# EAGLE design B-CAN-giraffe (EAGLE 9.0.1)
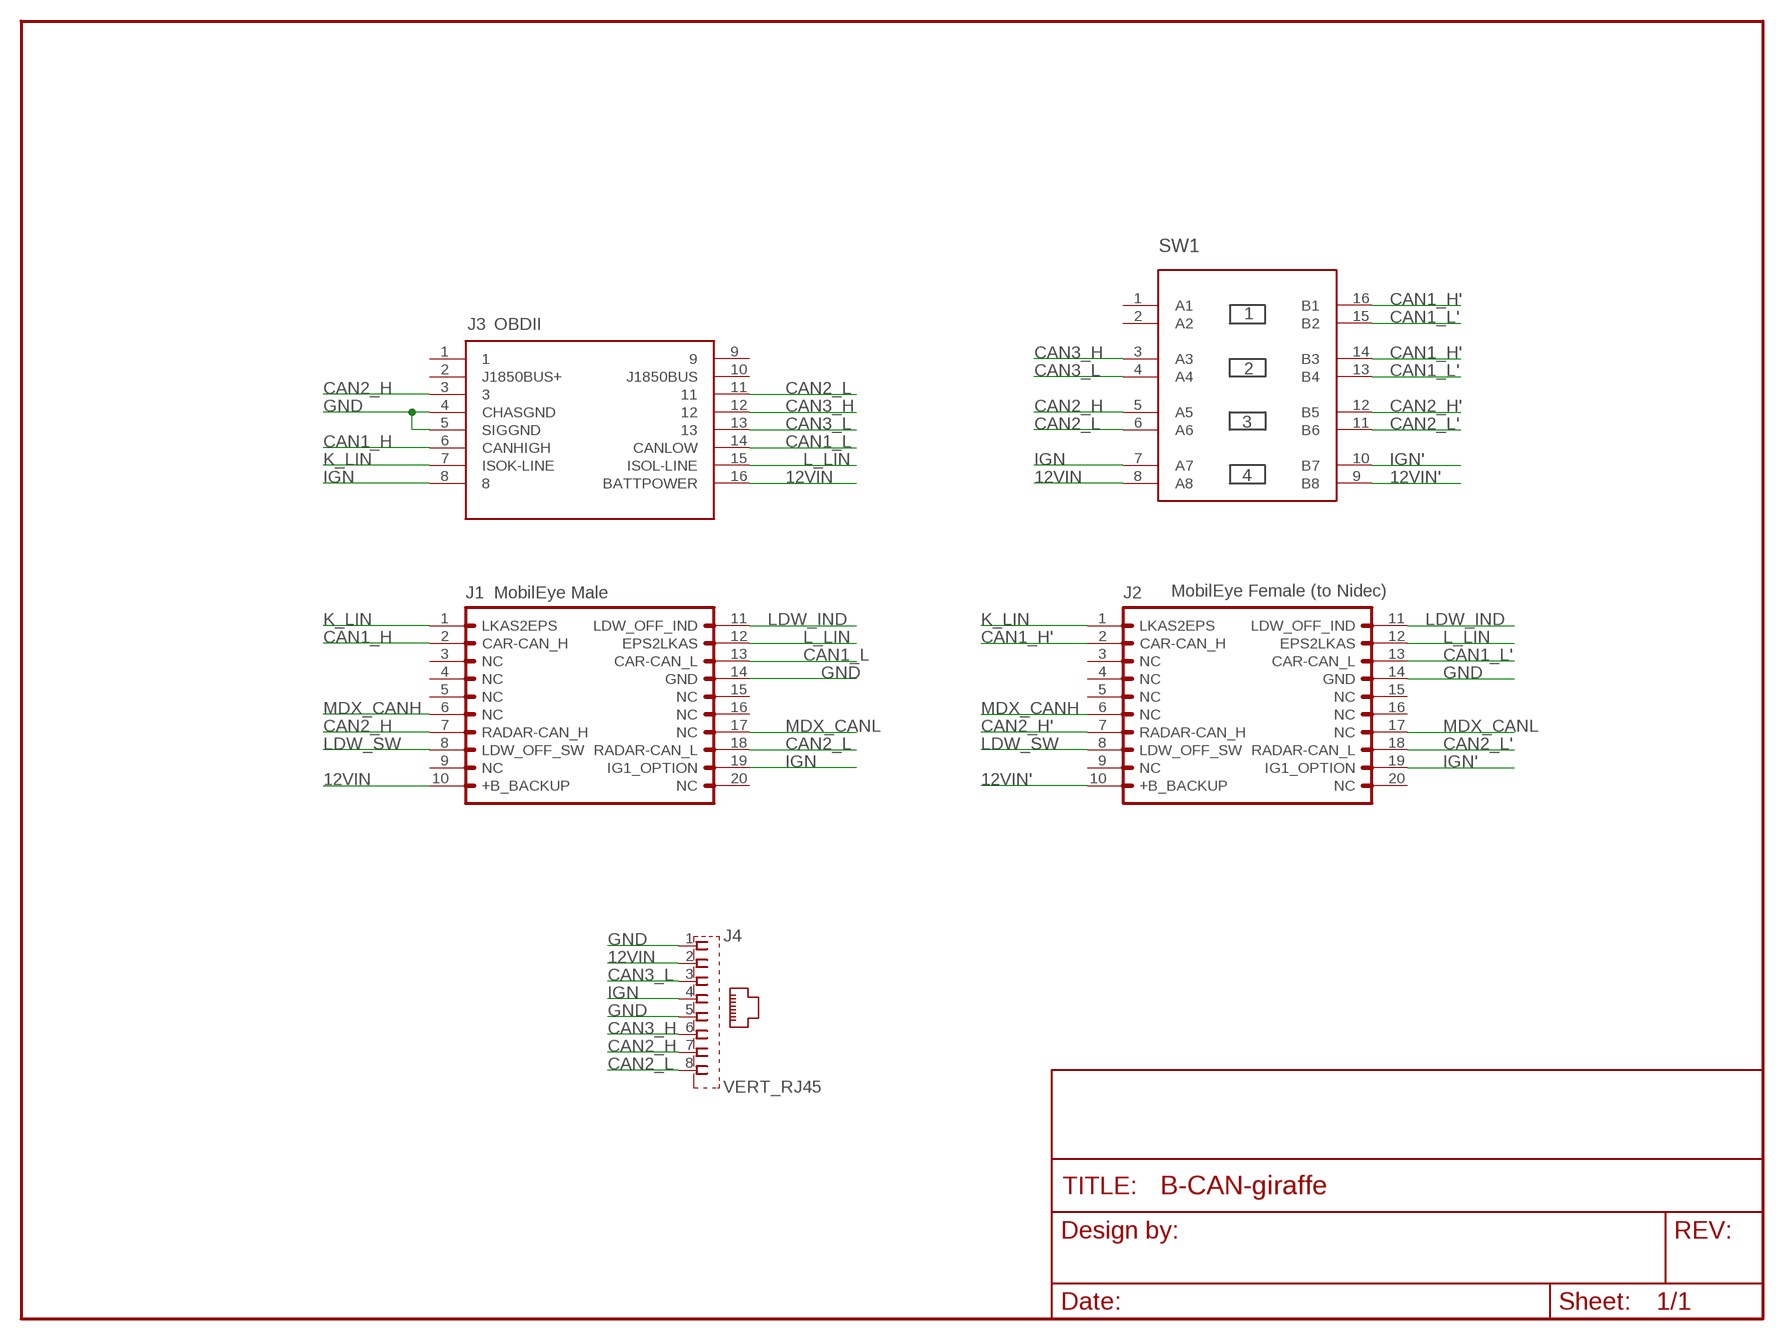
[diagram p0: schematic, sheet 1]

## Parts
FRAME1  FRAME-LETTERNO_PACKAGE  [DUMMY]
J1  MOBILEYERAMALE  [2X10(RA)]
J2  MOBILEYEFEMALE  [2X10(JAE_FEMALE)]
J3  OBDII-FEMALE-CUT  [OBDII-FEMALE-MIDCUT]
J4  VERT_RJ45  [GLX-S-88M]
SW1  4XDPSTSMT  [4-DPST]

## Nets
12VIN: J1.10(+B_BACKUP) J3.16(BATTPOWER) J4.2 SW1.8(A8)
12VIN': J2.10(+B_BACKUP) SW1.9(B8)
CAN1_H: J1.2(CAR-CAN_H) J3.6(CANHIGH)
CAN1_H': J2.2(CAR-CAN_H) SW1.14(B3) SW1.16(B1)
CAN1_L: J1.13(CAR-CAN_L) J3.14(CANLOW)
CAN1_L': J2.13(CAR-CAN_L) SW1.13(B4) SW1.15(B2)
CAN2_H: J1.7(RADAR-CAN_H) J3.3 J4.7 SW1.5(A5)
CAN2_H': J2.7(RADAR-CAN_H) SW1.12(B5)
CAN2_L: J1.18(RADAR-CAN_L) J3.11 J4.8 SW1.6(A6)
CAN2_L': J2.18(RADAR-CAN_L) SW1.11(B6)
CAN3_H: J3.12 J4.6 SW1.3(A3)
CAN3_L: J3.13 J4.3 SW1.4(A4)
GND: J1.14(GND) J2.14(GND) J3.4(CHASGND) J3.5(SIGGND) J4.1 J4.5
IGN: J1.19(IG1_OPTION) J3.8 J4.4 SW1.7(A7)
IGN': J2.19(IG1_OPTION) SW1.10(B7)
K_LIN: J1.1(LKAS2EPS) J2.1(LKAS2EPS) J3.7(ISOK-LINE)
L_LIN: J1.12(EPS2LKAS) J2.12(EPS2LKAS) J3.15(ISOL-LINE)
LDW_IND: J1.11(LDW_OFF_IND) J2.11(LDW_OFF_IND)
LDW_SW: J1.8(LDW_OFF_SW) J2.8(LDW_OFF_SW)
MDX_CANH: J1.6(NC) J2.6(NC)
MDX_CANL: J1.17(NC) J2.17(NC)
Unconnected: J1.3(NC) J1.4(NC) J1.5(NC) J1.9(NC) J1.15(NC) J1.16(NC) J1.20(NC) J2.3(NC) J2.4(NC) J2.5(NC) J2.9(NC) J2.15(NC) J2.16(NC) J2.20(NC) J3.1 J3.2(J1850BUS+) J3.9 J3.10(J1850BUS) SW1.1(A1) SW1.2(A2)

## Notes on the sheet
- OBDII
- MobilEye Male | MobilEye Female (to Nidec)

## Library data of the parts
FRAME1 = SparkFun-Aesthetics:FRAME-LETTER: Schematic Frame Standard 8.5x11 US Letter frame; DESIGNER: Nobody; VERSION: v01
J1 J2 = comma.ai:MOBILEYE: MobileEye connector for Acura ILX
J3 = comma.ai:OBDII-FEMALE
J4 = comma.ai:VERT_RJ45: Mod. Jack, Right Angle, 8 posiotion, 8 contatcs RJ45 Source: GLX-S-88M.pdf; OC_FARNELL: unknown; OC_NEWARK: unknown
SW1 = comma.ai:4XDPST

## Net classes
1 data: width 0.254 mm, clearance 0.254 mm

## Board
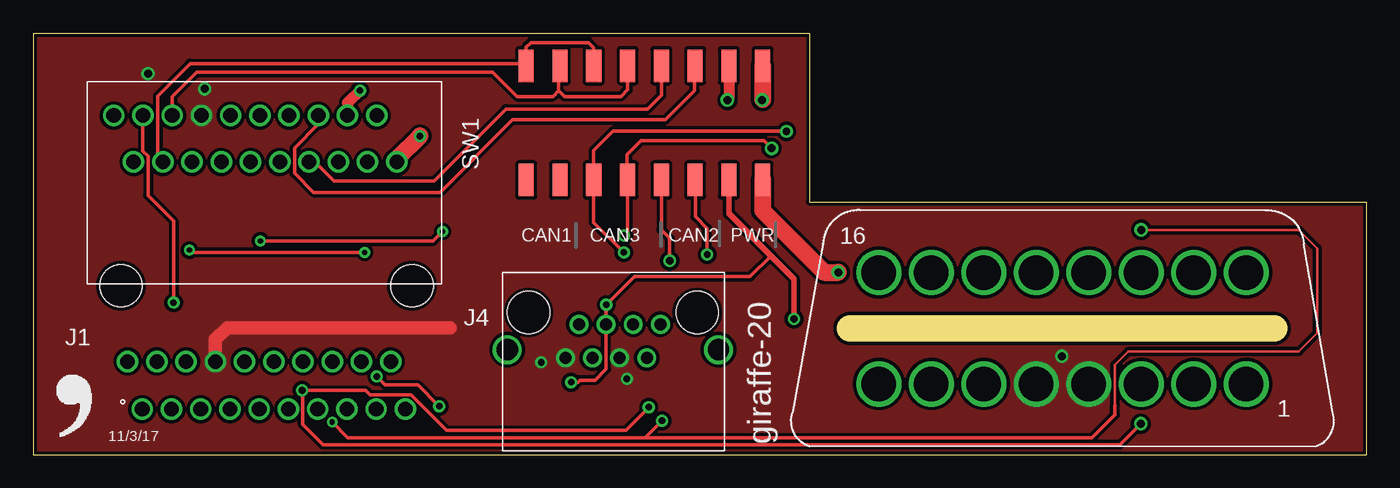
[diagram p1: board, top side]
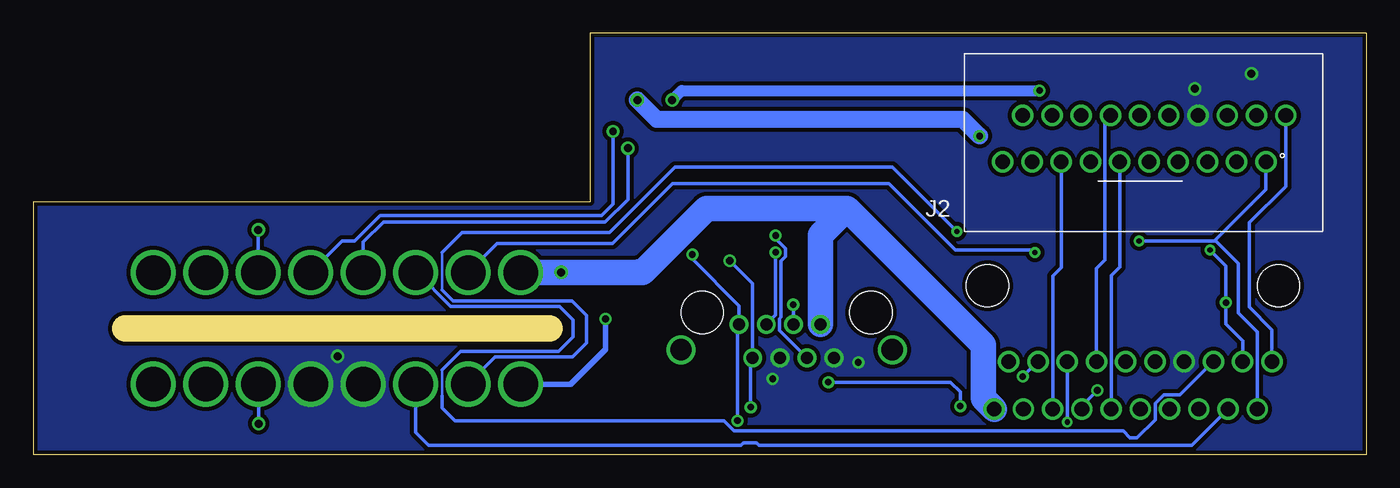
[diagram p2: board, bottom side, seen from below]

Size 100.33 x 31.75 mm. Coordinates in mm from the lower left corner, seen from the top.
Outline: 61.47,9.53 93.4,9.53
Outline: 0,31.75 58.42,31.75 58.42,19.05 100.33,19.05 100.33,0 0,0 0,31.75
Copper layers (1*16): Top 0.035mm / dielectric 1.5mm / Bottom 0.035mm
Design rules "default *": minimum track width 6mil, minimum drill 10mil, track to track 6mil, track to pad 6mil, pad to pad 6mil, via to via 6mil, smd to smd 6mil, copper to edge 10mil, drill to drill 10mil, minimum pad ring 10mil, minimum via ring 8mil, stop-mask expansion 4mil, vias tented up to drill 100mil, thermal gap 10mil
bRestrict: area 46,0.2 to 46.8,0.6

### Footprints (pad centres in the part's own frame; a part is rotated, then mirrored left to right if it is on the bottom)
2X10(RA) = drill 1.1 pad 1.422: 1 9.83,1.83; 2 7.63,1.83; 3 5.43,1.83; 4 3.23,1.83; 5 1.03,1.83; 6 -1.17,1.83; 7 -3.37,1.83; 8 -5.57,1.83; 9 -7.77,1.83; 10 -9.97,1.83; 11 10.93,-1.77; 12 8.73,-1.77; 13 6.53,-1.77; 14 4.33,-1.77; 15 2.13,-1.77; 16 -0.07,-1.77; 17 -2.27,-1.77; 18 -4.47,-1.77; 19 -6.67,-1.77; 20 -8.87,-1.77 | hole 3.2: -10.47,-7.47; 11.43,-7.47
2X10(JAE_FEMALE) = drill 1.1 pad 1.422: 1 -8.7,1.75; 2 -6.5,1.75; 3 -4.3,1.75; 4 -2.1,1.75; 5 0.1,1.75; 6 2.3,1.75; 7 4.5,1.75; 8 6.7,1.75; 9 8.9,1.75; 10 11.1,1.75; 11 -10.2,-1.75; 12 -8,-1.75; 13 -5.8,-1.75; 14 -3.6,-1.75; 15 -1.4,-1.75; 16 0.8,-1.75; 17 3,-1.75; 18 5.2,-1.75; 19 7.4,-1.75; 20 9.6,-1.75
OBDII-FEMALE-MIDCUT = drill 2.6 pad 3.4: 1 13.825,-4.2; 2 9.875,-4.2; 3 5.925,-4.2; 4 1.975,-4.2; 5 -1.975,-4.2; 6 -5.925,-4.2; 7 -9.875,-4.2; 8 -13.825,-4.2; 9 13.825,4.2; 10 9.875,4.2; 11 5.925,4.2; 12 1.975,4.2; 13 -1.975,4.2; 14 -5.925,4.2; 15 -9.875,4.2; 16 -13.825,4.2
GLX-S-88M = drill 0.9 pad 1.422: 1 -3.66,1.57; 2 -2.64,4.11; 3 -1.62,1.57; 4 -0.6,4.11; 5 0.42,1.57; 6 1.44,4.11; 7 2.46,1.57; 8 3.48,4.11 | drill 1.6 pad 2.184: S1 -8.04,2.2; S2 7.86,2.2 | hole 3.2: -6.44,5; 6.26,5
4-DPST = smd 1.13 x 2.44: 1 -8.89,-4.3; 2 -6.35,-4.3; 3 -3.81,-4.3; 4 -1.27,-4.3; 5 1.27,-4.3; 6 3.81,-4.3; 7 6.35,-4.3; 8 8.89,-4.3; 9 8.89,4.3; 10 6.35,4.3; 11 3.81,4.3; 12 1.27,4.3; 13 -1.27,4.3; 14 -3.81,4.3; 15 -6.35,4.3; 16 -8.89,4.3

### Placement (x,y rotation side)
FRAME1  -1.27,-12.7 0 top  (outside the outline)
J1  18.03,5.26 180 top
J2  16.26,23.8 180 bottom
J3  77.47,9.53 0 top
J4  43.72,5.71 0 top
SW1  46,24.99 0 top
U$1  [LOGO]  1.12,1.04 0 top

### Tracks (layer width: path | path; a pad name or v marks a point on that pad's centre or on a via)
12VIN  (via drill 0.6)
  Top 1.27: SW1.8 54.89,18.4 59.55,13.74 v60.59,13.74
  Bottom 1.905: J3.16 63.63,13.74 v60.59,13.74 54.81,13.74 | 54.81,13.74 54.81,13.77 | 54.81,13.74 54.46,13.74 49.66,18.54 39.09,18.54 | J1.10 28.81,4.24 28.81,8.26 39.09,18.54 | 39.09,18.54 41.08,16.55 J4.2
12VIN'  (via drill 0.5, 0.6)
  Top 0.813: 54.89,26.75 v54.86,26.72
  Top 1.27: SW1.9 54.89,26.75 | v29.11,24 27.36,22.25 J2.10
  Bottom 1.27: v54.86,26.72 53.42,25.27 30.38,25.27 v29.11,24
CAN1_H
  Bottom 0.254: J1.2 13.12,0.71 45.72,0.71 45.89,0.89 46.89,0.89 47.07,0.71 70.56,0.71 71.55,1.7 J3.6
CAN1_H'
  Top 0.254: J2.2 9.37,22.43 9.37,27.03 11.81,29.46 36.94,29.46 SW1.16 37.11,30.68 37.47,31.04 41.81,31.04 42.19,30.66 SW1.14
CAN1_L
  Bottom 0.203: 69.57,3.81 69.57,6.38
  Bottom 0.254: J1.13 14.02,4.51 15.25,4.51 15.89,3.88 15.89,2.64 17.26,1.27 17.78,1.27 18.3,1.79 47.58,1.79 48.33,2.54 68.58,2.54 69.57,3.53 69.57,3.81 69.57,4.42 | 69.57,6.38 68.81,7.14 68.17,7.77 60.81,7.77 59.69,8.89 59.69,10.16 60.71,11.18 68.91,11.18 71.45,13.72 J3.14
CAN1_L'
  Top 0.254: J2.13 10.46,26.98 12.32,28.83 34.57,28.83 36.42,26.98 39.12,26.98 39.55,27.41 | 39.55,27.41 39.55,29.19 SW1.15 | SW1.13 44.73,27.48 44.22,26.98 39.98,26.98 39.55,27.41
CAN2_H  (via drill 0.5, 0.55, 0.6)
  Top 0.254: v83.36,2.34 81.79,0.76 21.82,0.76 20.3,2.29 20.3,4.8 v20.24,4.85 25.02,4.85 25.36,4.51 28.45,4.51 31.11,1.85 44.6,1.85 v46.33,3.58 | SW1.5 47.27,16.94 47.9,16.31 v47.9,14.61
  Bottom 0.254: v83.36,2.34 83.36,5.29 J3.3 | v20.24,4.85 21.4,3.69 J1.7 | v46.33,3.58 46.33,7.13 J4.7 46.2,7.31 46.2,12.9 v47.9,14.61 47.9,14.55
CAN2_H'
  Top 0.254: J2.7 21.21,22.05 22.63,20.62 30.18,20.62 35.59,26.04 46.23,26.04 47.27,27.08 SW1.12
CAN2_L  (via drill 0.38, 0.5, 0.6)
  Top 0.203: v83.39,16.93 83.4,16.94 95.25,16.94 96.65,15.54 96.65,9.17 95.25,7.77 82.42,7.77 81.41,6.76 81.41,3.73
  Top 0.254: v22.5,2.46 23.67,1.29 46.05,1.29 | 46.05,1.29 79.68,1.29 81.41,3.02 81.41,3.73 | v83.39,16.93 v83.39,16.94 | v50.72,15.09 50.72,17.04 49.84,17.93 49.84,20.67 SW1.6 | v47.32,2.56 46.05,1.29
  Bottom 0.203: J1.18
  Bottom 0.254: v22.5,2.46 J1.18 | v83.39,16.94 J3.11 | v47.32,2.56 47.32,9.71 J4.8 47.2,11.21 50.72,14.73 v50.72,15.09
CAN2_L'
  Top 0.254: J2.18 21.46,24.89 19.66,23.09 19.66,21.21 21.11,19.76 30.61,19.76 36.09,25.25 47.6,25.25 49.78,27.43 SW1.11
CAN3_H  (via drill 0.5, 0.55)
  Top 0.254: SW1.3 42.19,22.91 43.64,24.36 v56.69,24.36 | SW1.3 | SW1.3 42.19,17.5 v44.45,15.24
  Bottom 0.254: J3.12 77.07,16.1 76.15,16.1 74.22,18.03 57.56,18.03 56.69,18.9 v56.69,24.36 | v44.45,15.24 44.45,10.54 J4.6
CAN3_L  (via drill 0.5, 0.6)
  Top 0.254: v55.58,23.09 55.02,23.65 45.74,23.65 44.7,22.61 44.7,20.72 SW1.4 44.73,16.79 v44.45,16.51
  Bottom 0.254: J3.13 75.49,16.01 73.97,17.53 57.28,17.53 55.58,19.23 v55.58,23.09 | v44.45,16.51 44.45,16.28 43.72,15.54 43.72,14.94 44.04,14.61 44.04,10.37 44.17,10.24 44.17,9.35 J4.3
GND  (via drill 0.5 pad 0.55, 0.6)
  Top 1.016: J1.14 13.7,8.68 14.58,9.55 31.37,9.55
  other vias: 12.9,27.56 8.64,28.7 38.23,6.96 44.68,5.71 77.42,7.42
  pour Top (isolate 0.254, no thermals): 0,31.75 0,0 100.33,0 100.33,19.05 58.42,19.05 58.42,31.75
  pour Bottom (isolate 0.305, no thermals): -0.05,31.8 58.42,31.8 58.42,19 100.3,19 100.3,0 -0.05,0
IGN  (via drill 0.5, 0.5 pad 0.55)
  Top 0.254: 26.14,5.61 v25.86,5.89 26.49,5.26 28.96,5.26 v30.56,3.66 | v40.49,5.46 41.02,5.46 41.17,5.61 42.29,5.61 43.13,6.45 v43.13,11.3 45.24,13.41 53.95,13.41 55.53,14.98
  Top 0.406: SW1.7 52.35,18.16 55.53,14.98 57.25,13.26 v57.25,10.24
  Bottom 0.254: J1.19 24.72,7.03 v25.86,5.89 | v43.13,11.3 v43.12,11.29 J4.4 | v40.49,5.46 31.29,5.46 30.56,4.72 v30.56,3.66
  Bottom 0.406: J3.8 63.63,5.31 59.89,5.31 57.25,7.95 v57.25,10.24
IGN'  (via drill 0.5, 0.6)
  Top 0.813: SW1.10 52.35,26.82 v52.25,26.72 | v24.59,27.43 23.66,26.5 J2.19
  Bottom 0.813: v52.25,26.72 51.54,27.43 v24.59,27.43
K_LIN  (via drill 0.4)
  Top 0.254: v17.09,16.1 30.1,16.1 v30.81,16.82
  Bottom 0.203: 69.55,15.24 69.55,14.54 69.55,14.53 69.55,12.39
  Bottom 0.254: 69.55,15.24 68.05,16.74 56.97,16.74 52.05,21.67 35.66,21.67 v30.81,16.82 | J1.1 8.2,9.27 9.63,10.69 9.63,14.41 11.32,16.1 11.43,16.1 | 69.55,12.39 68.74,11.58 59.77,11.58 58.67,10.49 58.67,8.43 59.74,7.37 65.55,7.37 J3.7 | 11.43,16.1 7.56,19.98 J2.1 | 11.43,16.1 v17.09,16.1
L_LIN  (via drill 0.4, 0.5)
  Top 0.254: 8.64,21.6 8.64,22.5 8.26,22.88 J2.12 | 8.64,21.6 | 8.64,21.6 8.64,19.53 10.57,17.6 v10.57,11.46 | v24.94,15.24 11.94,15.24 v11.76,15.42
  Bottom 0.254: J3.15 65.42,15.9 56.72,15.9 52.2,20.42 35.94,20.42 30.94,15.42 25.12,15.42 v24.94,15.24 | J1.12 9.3,8.59 10.57,9.86 v10.57,11.46 10.57,14.22 v11.76,15.42
LDW_IND
  Bottom 0.254: J1.11 7.1,9.41 8.81,11.12 8.81,17.48 6.07,20.22 6.07,25.54 J2.11
LDW_SW
  Bottom 0.254: J1.8 23.6,13.48 22.96,14.12 22.96,19.05 | 22.96,18.49 22.96,19.05 | 22.96,19.05 J2.8
MDX_CANH
  Bottom 0.254: J2.6 18.54,22.04 18.54,14.15 19.2,13.49 J1.6
MDX_CANL
  Bottom 0.254: J2.17 19.66,25.15 19.66,17.78 | 19.66,17.78 19.66,17.7 | J1.17 20.3,14.04 19.66,14.68 19.66,17.78

### Text on the board
tPlace: CAN1 | CAN3 | CAN2 | PWR | 11/3/17 | giraffe-20
Document: *compatible with freeTheC pins soldered on TOP